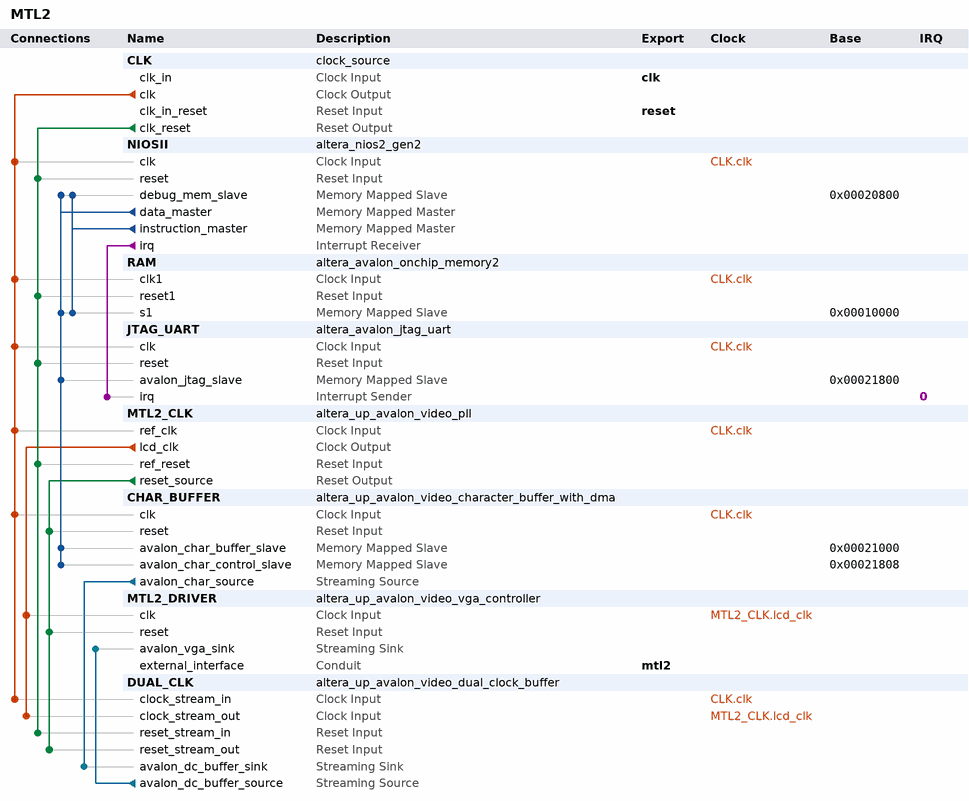
[diagram p0: system contents]
# Platform Designer (Qsys) system MTL2, Cyclone V 5CSEMA5F31C6
# Parameters at their usual value, and those the tool derives, are not listed.
package require -exact qsys 18.1
create_system MTL2
set_project_property DEVICE_FAMILY {Cyclone V}
set_project_property DEVICE 5CSEMA5F31C6

add_instance CLK clock_source 18.1
set_instance_parameter_value CLK clockFrequency 50000000

add_instance NIOSII altera_nios2_gen2 18.1
set_instance_parameter_value NIOSII dcache_size 2048
set_instance_parameter_value NIOSII exceptionSlave RAM.s1
set_instance_parameter_value NIOSII icache_size 4096
set_instance_parameter_value NIOSII impl Tiny
set_instance_parameter_value NIOSII resetSlave RAM.s1

add_instance RAM altera_avalon_onchip_memory2 18.1
set_instance_parameter_value RAM dataWidth 32
set_instance_parameter_value RAM dualPort false
set_instance_parameter_value RAM initMemContent true
set_instance_parameter_value RAM initializationFileName onchip_mem.hex
set_instance_parameter_value RAM memorySize 65536

add_instance JTAG_UART altera_avalon_jtag_uart 18.1
set_instance_parameter_value JTAG_UART simInteractiveOptions NO_INTERACTIVE_WINDOWS

add_instance MTL2_CLK altera_up_avalon_video_pll 18.0
set_instance_parameter_value MTL2_CLK camera {5MP Digital Camera (THDB_D5M)}
set_instance_parameter_value MTL2_CLK gui_refclk 33.3
set_instance_parameter_value MTL2_CLK lcd {7" LCD on VEEK-MT and MTL/MTL2 Modules}
set_instance_parameter_value MTL2_CLK lcd_clk_en true
set_instance_parameter_value MTL2_CLK vga_clk_en false

add_instance CHAR_BUFFER altera_up_avalon_video_character_buffer_with_dma 18.0
set_instance_parameter_value CHAR_BUFFER enable_transparency false
set_instance_parameter_value CHAR_BUFFER vga_device {LCD with touchscreen (TRDB_LTM)}

add_instance MTL2_DRIVER altera_up_avalon_video_vga_controller 18.0
set_instance_parameter_value MTL2_DRIVER board DE1-SoC
set_instance_parameter_value MTL2_DRIVER resolution {VGA 640x480}

add_instance DUAL_CLK altera_up_avalon_video_dual_clock_buffer 18.0
set_instance_parameter_value DUAL_CLK color_bits 10

# connections
add_connection CLK.clk CHAR_BUFFER.clk clock
add_connection CLK.clk DUAL_CLK.clock_stream_in clock
add_connection CLK.clk JTAG_UART.clk clock
add_connection CLK.clk MTL2_CLK.ref_clk clock
add_connection CLK.clk NIOSII.clk clock
add_connection CLK.clk RAM.clk1 clock
add_connection MTL2_CLK.lcd_clk DUAL_CLK.clock_stream_out clock
add_connection MTL2_CLK.lcd_clk MTL2_DRIVER.clk clock
add_connection CLK.clk_reset DUAL_CLK.reset_stream_in reset
add_connection CLK.clk_reset JTAG_UART.reset reset
add_connection CLK.clk_reset MTL2_CLK.ref_reset reset
add_connection CLK.clk_reset NIOSII.reset reset
add_connection CLK.clk_reset RAM.reset1 reset
add_connection MTL2_CLK.reset_source CHAR_BUFFER.reset reset
add_connection MTL2_CLK.reset_source DUAL_CLK.reset_stream_out reset
add_connection MTL2_CLK.reset_source MTL2_DRIVER.reset reset
add_connection NIOSII.data_master CHAR_BUFFER.avalon_char_buffer_slave avalon
set_connection_parameter_value NIOSII.data_master/CHAR_BUFFER.avalon_char_buffer_slave baseAddress 0x00021000
add_connection NIOSII.data_master CHAR_BUFFER.avalon_char_control_slave avalon
set_connection_parameter_value NIOSII.data_master/CHAR_BUFFER.avalon_char_control_slave baseAddress 0x00021808
add_connection NIOSII.data_master JTAG_UART.avalon_jtag_slave avalon
set_connection_parameter_value NIOSII.data_master/JTAG_UART.avalon_jtag_slave baseAddress 0x00021800
add_connection NIOSII.data_master NIOSII.debug_mem_slave avalon
set_connection_parameter_value NIOSII.data_master/NIOSII.debug_mem_slave baseAddress 0x00020800
add_connection NIOSII.data_master RAM.s1 avalon
set_connection_parameter_value NIOSII.data_master/RAM.s1 baseAddress 0x00010000
add_connection NIOSII.instruction_master NIOSII.debug_mem_slave avalon
set_connection_parameter_value NIOSII.instruction_master/NIOSII.debug_mem_slave baseAddress 0x00020800
add_connection NIOSII.instruction_master RAM.s1 avalon
set_connection_parameter_value NIOSII.instruction_master/RAM.s1 baseAddress 0x00010000
add_connection CHAR_BUFFER.avalon_char_source DUAL_CLK.avalon_dc_buffer_sink avalon_streaming
add_connection DUAL_CLK.avalon_dc_buffer_source MTL2_DRIVER.avalon_vga_sink avalon_streaming
add_connection NIOSII.irq JTAG_UART.irq interrupt
set_connection_parameter_value NIOSII.irq/JTAG_UART.irq irqNumber 0

# exported interfaces
add_interface clk clock sink
set_interface_property clk EXPORT_OF CLK.clk_in
add_interface mtl2 conduit end
set_interface_property mtl2 EXPORT_OF MTL2_DRIVER.external_interface
add_interface reset reset sink
set_interface_property reset EXPORT_OF CLK.clk_in_reset

set_interconnect_requirement {$system} qsys_mm.clockCrossingAdapter HANDSHAKE
set_interconnect_requirement {$system} qsys_mm.enableEccProtection FALSE
set_interconnect_requirement {$system} qsys_mm.insertDefaultSlave FALSE
set_interconnect_requirement {$system} qsys_mm.maxAdditionalLatency 1

save_system MTL2.qsys
